# EAGLE design Shield PCB (EAGLE 9.6.2)
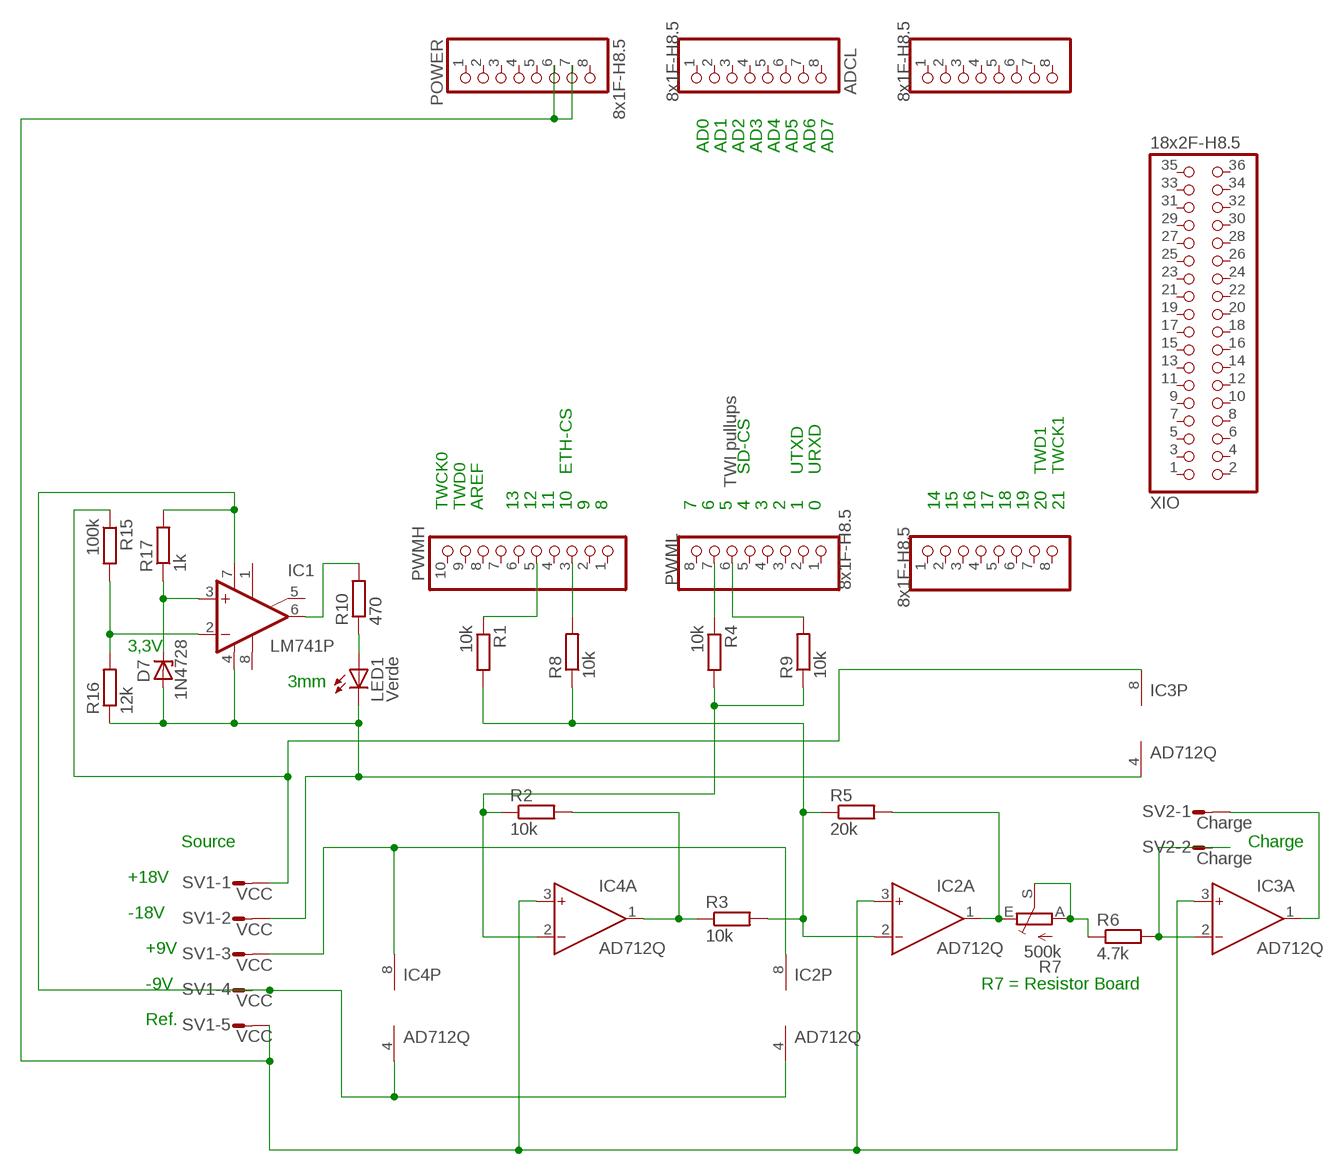
[diagram p0: schematic, sheet 1]

## Parts
ADCH  8x1F-H8.5  PINHD-1X8  [1X08]
ADCL  8x1F-H8.5  PINHD-1X8  [1X08]
COMMUNICATION  8x1F-H8.5  PINHD-1X8  [1X08]
D7  1N4728  [DO41Z10]
IC1  LM741P  [DIL08]
IC2  AD712Q  [DIL08]
IC3  AD712Q  [DIL08]
IC4  AD712Q  [DIL08]
LED1  Verde  LED3MM  [LED3MM]
POWER  8x1F-H8.5  PINHD-1X8  [1X08]
PWMH  10x1F-H8.5  PINHD-1X10  [1X10]
PWML  8x1F-H8.5  PINHD-1X8  [1X08]
R1  10k  R-EU_0207/10  [0207/10]
R2  10k  R-EU_0207/10  [0207/10]
R3  10k  R-EU_0207/10  [0207/10]
R4  10k  R-EU_0207/10  [0207/10]
R5  20k  R-EU_0207/10  [0207/10]
R6  4.7k  R-EU_0207/10  [0207/10]
R7  500k  TRIM_EU-B64Y  [B64Y]
R8  10k  R-EU_0207/10  [0207/10]
R9  10k  R-EU_0207/10  [0207/10]
R10  470  R-EU_0207/10  [0207/10]
R15  100k  R-EU_0207/10  [0207/10]
R16  12k  R-EU_0207/10  [0207/10]
R17  1k  R-EU_0207/10  [0207/10]
SV1  VCC  L05P  [L05P]
SV2  Charge  L02P  [L02P]
XIO  18x2F-H8.5  PINHD-2X18  [2X18]

## Nets
N$1: IC4.2(A:IN-) R2.1 R4.2 R9.1
N$2: IC4.1(A:OUT) R2.2 R3.1
N$3: IC2.2(A:IN-) R1.2 R3.2 R5.1 R8.1
N$4: IC2.1(A:OUT) R5.2 R7.E
N$5: IC3.2(A:IN-) R6.2 SV2.2
N$6: R6.1 R7.A R7.S
N$7: IC3.1(A:OUT) SV2.1
N$8: PWMH.3 R8.2
N$9: PWMH.5 R1.1
N$10: PWML.7 R4.1
N$11: PWML.6 R9.2
N$21: IC3.8(P:V+) R15.1 SV1.1
N$22: D7.A IC1.4(V-) IC3.4(P:V-) LED1.K(C) R16.1 SV1.2
N$23: IC1.7(V+) IC2.4(P:V-) IC4.4(P:V-) R17.2 SV1.4
N$25: IC2.3(A:IN+) IC3.3(A:IN+) IC4.3(A:IN+) POWER.6 POWER.7 SV1.5
N$30: D7.C IC1.3(+IN) R17.1
N$31: IC1.2(-IN) R15.2 R16.2
N$32: IC1.6(OUT) R10.2
N$33: LED1.A R10.1
N$36: IC2.8(P:V+) IC4.8(P:V+) SV1.3
Unconnected: ADCH.1 ADCH.2 ADCH.3 ADCH.4 ADCH.5 ADCH.6 ADCH.7 ADCH.8 ADCL.1 ADCL.2 ADCL.3 ADCL.4 ADCL.5 ADCL.6 ADCL.7 ADCL.8 COMMUNICATION.1 COMMUNICATION.2 COMMUNICATION.3 COMMUNICATION.4 COMMUNICATION.5 COMMUNICATION.6 COMMUNICATION.7 COMMUNICATION.8 IC1.1(ON1) IC1.5(ON2) IC1.8(OPT) IC2.5(B:IN+) IC2.6(B:IN-) IC2.7(B:OUT) IC3.5(B:IN+) IC3.6(B:IN-) IC3.7(B:OUT) IC4.5(B:IN+) IC4.6(B:IN-) IC4.7(B:OUT) POWER.1 POWER.2 POWER.3 POWER.4 POWER.5 POWER.8 PWMH.1 PWMH.2 PWMH.4 PWMH.6 PWMH.7 PWMH.8 PWMH.9 PWMH.10 PWML.1 PWML.2 PWML.3 PWML.4 PWML.5 PWML.8 XIO.1 XIO.2 XIO.3 XIO.4 XIO.5 XIO.6 XIO.7 XIO.8 XIO.9 XIO.10 XIO.11 XIO.12 XIO.13 XIO.14 XIO.15 XIO.16 XIO.17 XIO.18 XIO.19 XIO.20 XIO.21 XIO.22 XIO.23 XIO.24 XIO.25 XIO.26 XIO.27 XIO.28 XIO.29 XIO.30 XIO.31 XIO.32 XIO.33 XIO.34 XIO.35 XIO.36

## Notes on the sheet
- AD0 | AD1 | AD2 | AD3 | AD4 | AD5 | AD6 | AD7
- ETH-CS | SD-CS | UTXD | URXD | TWD1 | TWCK1
- TWI pullups
- TWCK0 | TWD0 | AREF | 13 | 12 | 11 | 10 | 9 | 8 | 7 | 6 | 5 | 4 | 3 | 2 | 1 | 0 | 14 | 15 | 16 | 17 | 18 | 19 | 20 | 21
- 3,3V
- 3mm
- Source | Charge
- +18V
- -18V
- +9V
- -9V | R7 = Resistor Board
- Ref.

## Library data of the parts
ADCH ADCL COMMUNICATION POWER PWML = SmartPrj:PINHD-1X8: PIN HEADER
D7 = diode:1N4728: Z DIODE 3.3 V, 1W, 5 percent
IC1 = linear:*741: OP AMP
IC2-IC4 = analog-devices:AD712: Dual Precision, Low Cost, High Speed BiFET Op Amp Source: http://www.analog.com/static/imported-files/data_sheets/AD712.pdf; MF: ALTERA CORPORATION; MPN: AD712AQ; OC_FARNELL: 9604898; OC_NEWARK: 05F7274
LED1 = led:LED: LED OSRAM: - CHIPLED LG R971, LG N971, LY N971, LG Q971, LY Q971, LO R971, LY R971 LH N974, LH R974 LS Q976, LO Q976, LY Q976 LO Q996 - Hyper CHIPLED LW Q18S LB Q993, LB Q99A, LB R99A - SideLED LS A670, LO A670, LY A670, LG A670, LP A670 LB A673, LV A673, LT A673, LW A673 LH A674 LY A675 LS A676, LA A676, LO A676, LY A676, LW A676 LS A679, LY A679, LG A679 - Hyper Micro SIDELED® LS Y876, LA Y876, LO Y876, LY Y876 LT Y87S - SmartLED LW L88C, LW L88S LB L89C, LB L89S, LG L890 LS L89K, LO L89K, LY L89K LS L896, LA L896, LO L896, LY L896 - TOPLED LS T670, LO T670, LY T670, LG T670, LP T670 LSG T670, LSP T670, LSY T670, LOP T670, LYG T670 LG T671, LOG T671, LSG T671 LB T673, LV T673, LT T673, LW T673 LH T674 LS T676, LA T676, LO T676, LY T676, LB T676, LH T676, LSB T676, LW T676 LB T67C, LV T67C, LT T67C, LS T67K, LO T67K, LY T67K, LW E67C LS E67B, LA E67B, LO E67B, LY E67B, LB E67C, LV E67C, LT E67C LW T67C LS T679, LY T679, LG T679 LS T770, LO T770, LY T770, LG T770, LP T770 LB T773, LV T773, LT T773, LW T773 LH T774 LS E675, LA E675, LY E675, LS T675 LS T776, LA T776, LO T776, LY T776, LB T776 LHGB T686 LT T68C, LB T68C - Hyper Mini TOPLED® LB M676 - Mini TOPLED Santana® LG M470 LS M47K, LO M47K, LY M47K Source: http://www.osram.convergy.de LUXEON: - LUMILED® LXK2-PW12-R00, LXK2-PW12-S00, LXK2-PW14-U00, LXK2-PW14-V00 LXK2-PM12-R00, LXK2-PM12-S00, LXK2-PM14-U00 LXK2-PE12-Q00, LXK2-PE12-R00, LXK2-PE12-S00, LXK2-PE14-T00, LXK2-PE14-U00 LXK2-PB12-K00, LXK2-PB12-L00, LXK2-PB12-M00, LXK2-PB14-N00, LXK2-PB14-P00, LXK2-PB14-Q00 LXK2-PR12-L00, LXK2-PR12-M00, LXK2-PR14-Q00, LXK2-PR14-R00 LXK2-PD12-Q00, LXK2-PD12-R00, LXK2-PD12-S00 LXK2-PH12-R00, LXK2-PH12-S00 LXK2-PL12-P00, LXK2-PL12-Q00, LXK2-PL12-R00 Source: www.luxeon.com KINGBRIGHT: KA-3528ASYC Source: www.kingbright.com
PWMH = SmartPrj:PINHD-1X10: PIN HEADER
R1-R5 R8-R10 R15-R17 = resistor:R-EU_: RESISTOR, European symbol
R6 = rcl:R-EU_: RESISTOR, European symbol
R7 = pot:TRIM_EU-: POTENTIOMETER
SV1 = con-amp-mt:L05P: AMP MT CONNECTOR; OC_FARNELL: unknown; OC_NEWARK: unknown
SV2 = con-amp-mt:L02P: AMP MT CONNECTOR; OC_FARNELL: unknown; OC_NEWARK: unknown
XIO = SmartPrj:PINHD-2X18: PIN HEADER

## Board
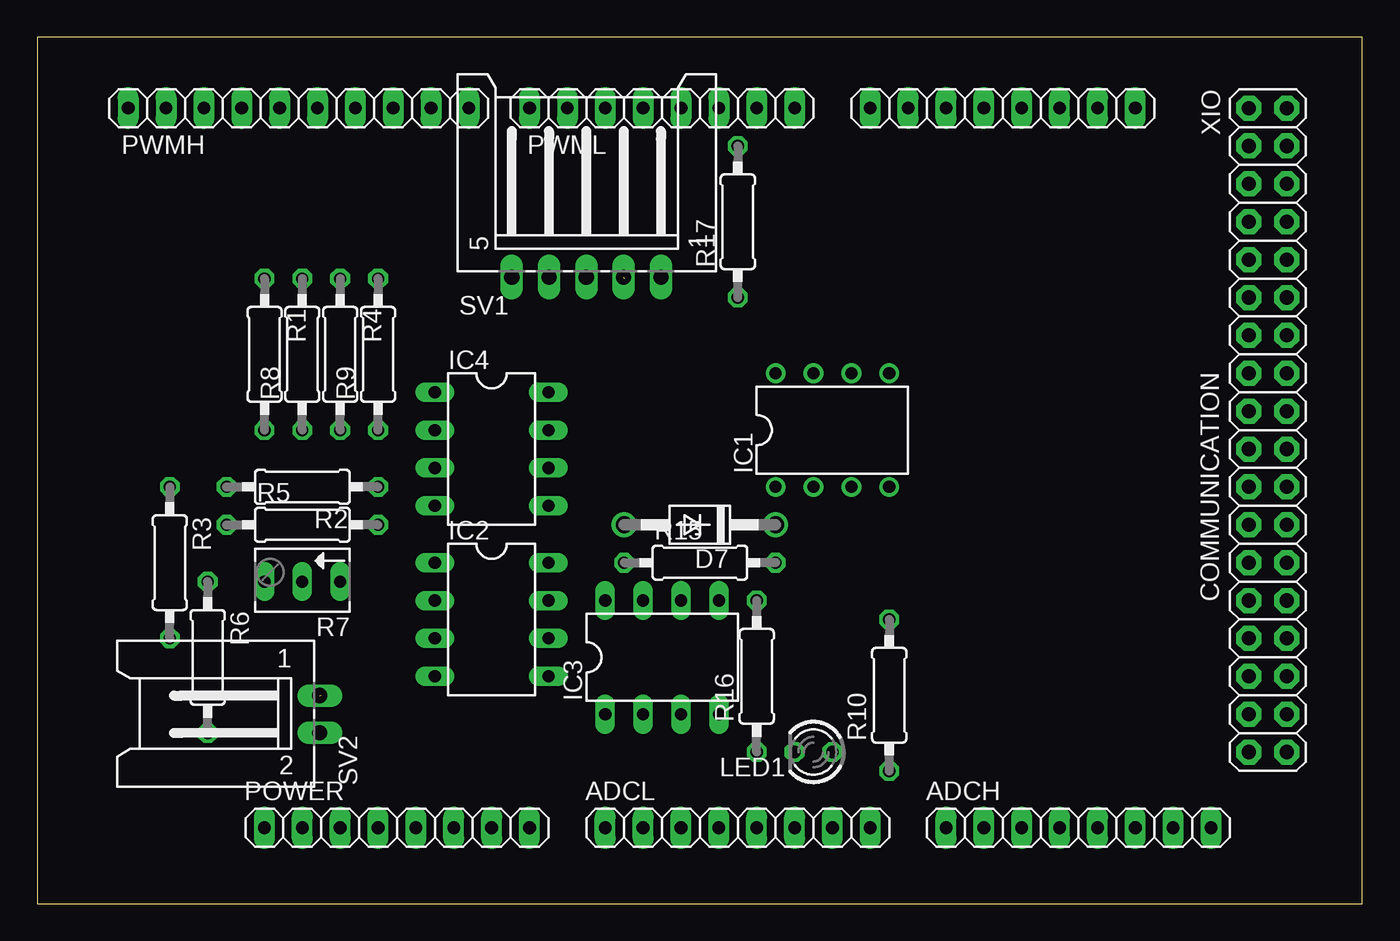
[diagram p1: board, top side]
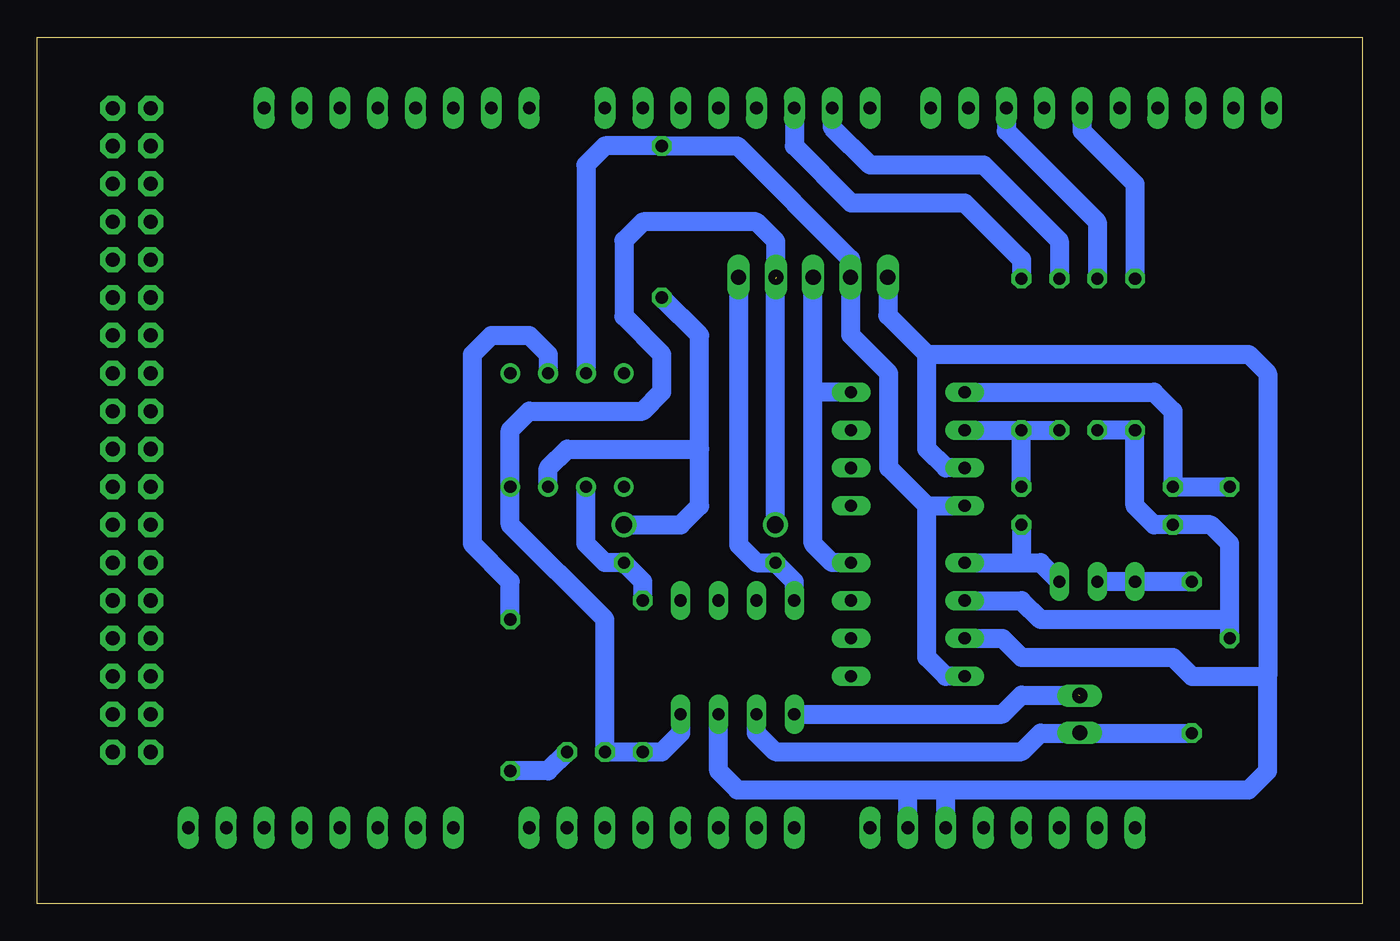
[diagram p2: board, bottom side, seen from below]

Size 88.88 x 58.09 mm. Coordinates in mm from the lower left corner, seen from the top.
Outline: 0,0 88.88,0 88.88,58.09 0,58.09 0,0
Copper layers (1*16): Top 0.035mm / dielectric 1.5mm / Bottom 0.035mm
Design rules "default": minimum track width 10mil, minimum drill 24mil, track to track 8mil, track to pad 8mil, pad to pad 8mil, via to via 8mil, smd to smd 8mil, copper to edge 40mil, drill to drill 8mil, minimum pad ring 10mil, minimum via ring 8mil, stop-mask expansion 4mil, vias tented up to drill 0mil, thermal gap 10mil

### Footprints (pad centres in the part's own frame; a part is rotated, then mirrored left to right if it is on the bottom)
1X08 = drill 0.85 pad 1.422 long: 1 -8.89,0; 2 -6.35,0; 3 -3.81,0; 4 -1.27,0; 5 1.27,0; 6 3.81,0; 7 6.35,0; 8 8.89,0
DO41Z10 = drill 1.118: A 5.08,0; C -5.08,0
DIL08 = drill 0.813 pad 1.27: 1 -3.81,-3.81; 2 -1.27,-3.81; 3 1.27,-3.81; 4 3.81,-3.81; 5 3.81,3.81; 6 1.27,3.81; 7 -1.27,3.81; 8 -3.81,3.81
DIL08' = drill 0.813 long: 1 -3.81,-3.81; 2 -1.27,-3.81; 3 1.27,-3.81; 4 3.81,-3.81; 5 3.81,3.81; 6 1.27,3.81; 7 -1.27,3.81; 8 -3.81,3.81
LED3MM = drill 0.813 octagon: A -1.27,0; K 1.27,0
1X10 = drill 0.85 pad 1.422 long: 1 -11.43,0; 2 -8.89,0; 3 -6.35,0; 4 -3.81,0; 5 -1.27,0; 6 1.27,0; 7 3.81,0; 8 6.35,0; 9 8.89,0; 10 11.43,0
0207/10 = drill 0.813 octagon: 1 -5.08,0; 2 5.08,0
B64Y = drill 0.813 long: A 2.54,0; E -2.54,0; S 0,0
L05P = drill 1.016 long: 1 5,-6.25; 2 2.5,-6.25; 3 0,-6.25; 4 -2.5,-6.25; 5 -5,-6.25
L02P = drill 1.016 long: 1 1.25,-6.25; 2 -1.25,-6.25
2X18 = drill 0.95 pad 1.676 octagon: 1 -21.59,-1.27; 2 -21.59,1.27; 3 -19.05,-1.27; 4 -19.05,1.27; 5 -16.51,-1.27; 6 -16.51,1.27; 7 -13.97,-1.27; 8 -13.97,1.27; 9 -11.43,-1.27; 10 -11.43,1.27; 11 -8.89,-1.27; 12 -8.89,1.27; 13 -6.35,-1.27; 14 -6.35,1.27; 15 -3.81,-1.27; 16 -3.81,1.27; 17 -1.27,-1.27; 18 -1.27,1.27; 19 1.27,-1.27; 20 1.27,1.27; 21 3.81,-1.27; 22 3.81,1.27; 23 6.35,-1.27; 24 6.35,1.27; 25 8.89,-1.27; 26 8.89,1.27; 27 11.43,-1.27; 28 11.43,1.27; 29 13.97,-1.27; 30 13.97,1.27; 31 16.51,-1.27; 32 16.51,1.27; 33 19.05,-1.27; 34 19.05,1.27; 35 21.59,-1.27; 36 21.59,1.27

### Placement (x,y rotation side)
ADCH  69.85,5.08 0 top
ADCL  46.99,5.08 0 top
COMMUNICATION  64.77,53.34 0 top
D7  44.45,25.4 180 top
IC1  53.34,31.75 0 top
IC2  AD712Q  [DIL08']  30.48,19.05 270 top
IC3  AD712Q  [DIL08']  41.91,16.51 0 top
IC4  AD712Q  [DIL08']  30.48,30.48 270 top
LED1  52.07,10.16 180 top
POWER  24.13,5.08 0 top
PWMH  17.53,53.34 180 top
PWML  41.91,53.34 180 top
R1  15.24,36.83 270 top
R2  17.78,27.94 180 top
R3  8.89,22.86 270 top
R4  20.32,36.83 270 top
R5  17.78,25.4 0 top
R6  11.43,16.51 270 top
R7  17.78,21.59 180 top
R8  17.78,36.83 90 top
R9  22.86,36.83 90 top
R10  57.15,13.97 90 top
R15  44.45,22.86 0 top
R16  48.26,15.24 90 top
R17  46.99,45.72 90 top
SV1  36.83,48.26 0 top
SV2  12.7,12.7 90 top
XIO  82.55,31.75 270 top

### Tracks (layer width: path | path; a pad name or v marks a point on that pad's centre or on a via)
N$1
  Bottom 1.27: R2.1 R9.1 | IC4.2 R9.1 | R9.1 R4.2
N$2
  Bottom 1.27: IC4.1 13.97,34.29 12.7,33.02 R2.2 R3.1
N$3
  Bottom 1.27: R3.2 8.89,19.05 | 8.89,19.05 8.89,24.13 10.16,25.4 R5.1 13.97,25.4 15.24,26.67 R1.2 R8.1 | 8.89,19.05 21.59,19.05 22.86,20.32 IC2.2
N$4
  Bottom 1.27: IC2.1 22.86,22.86 | R7.E 21.59,22.86 22.86,22.86 | R5.2 22.86,22.86
N$5
  Bottom 1.27: IC3.2 40.64,11.43 39.39,10.18 22.84,10.18 21.59,11.43 18.97,11.43 SV2.2 18.93,11.43 R6.2
N$6
  Bottom 1.27: R6.1 R7.A R7.S
N$7  (1 unrouted)
  Bottom 1.27: IC3.1 24.13,12.7 22.86,13.97 19.05,13.97
N$8
  Bottom 1.27: PWMH.3 23.88,51.82 17.78,45.72 R8.2
N$9
  Bottom 1.27: PWMH.5 18.8,51.82 15.24,48.26 R1.1
N$10
  Bottom 1.27: PWML.7 35.56,52.07 33.02,49.53 25.4,49.53 20.32,44.45 R4.1
N$11
  Bottom 1.27: PWML.6 38.1,50.8 34.29,46.99 26.67,46.99 22.86,43.18 R9.2
N$21
  Bottom 1.27: SV1.1 41.83,24.05 40.64,22.86 R15.1 38.1,21.59 IC3.8
N$22  (1 unrouted)
  Bottom 1.27: SV1.2 39.33,44.41 40.64,45.72 48.26,45.72 49.53,44.45 49.53,39.37 46.99,36.83 46.99,34.29 48.26,33.02 55.88,33.02 57.15,31.75 IC1.4 57.15,25.4 50.8,19.05 LED1.K R16.1 46.99,10.16 45.72,11.43 IC3.4 | D7.A 39.37,41.91
N$23
  Bottom 1.27: IC2.4 27.94,15.24 29.21,16.51 29.21,26.67 | 29.21,26.67 31.75,29.21 31.75,35.56 34.33,38.14 SV1.4 34.33,43.22 41.91,50.8 R17.2 50.8,50.8 52.07,49.53 IC1.7 | 29.21,26.67 IC4.4
N$25
  Bottom 1.27: 29.21,36.83 7.62,36.83 6.35,35.56 6.35,15.24 | IC4.3 27.94,29.21 29.21,30.48 29.21,36.83 | 6.35,15.24 11.43,15.24 12.7,16.51 22.86,16.51 24.13,17.78 IC2.3 | SV1.5 31.83,39.45 29.21,36.83 | 30.48,7.62 41.91,7.62 43.18,8.89 IC3.3 | 30.48,7.62 27.94,7.62 | 27.94,7.62 7.62,7.62 6.35,8.89 6.35,15.24 | POWER.6 27.94,7.62 | POWER.7 30.48,7.62
N$30
  Bottom 1.27: D7.C 45.72,25.4 44.45,26.67 44.45,30.48 | 44.45,30.48 44.45,38.1 R17.1 | IC1.3 54.61,29.21 53.34,30.48 44.45,30.48
N$31
  Bottom 1.27: R16.2 48.26,21.59 R15.2 50.8,22.86 52.07,24.13 IC1.2
N$32
  Bottom 1.27: IC1.6 54.61,36.83 55.88,38.1 58.42,38.1 59.69,36.83 59.69,24.13 57.15,21.59 R10.2
N$33
  Bottom 1.27: LED1.A 54.61,8.89 R10.1
N$36
  Bottom 1.27: IC2.8 35.56,22.86 36.83,24.13 36.83,34.29 | IC4.8 36.83,34.29 | 36.83,34.29 SV1.3